# EAGLE design mr_radar_sandbox (EAGLE 5.11)
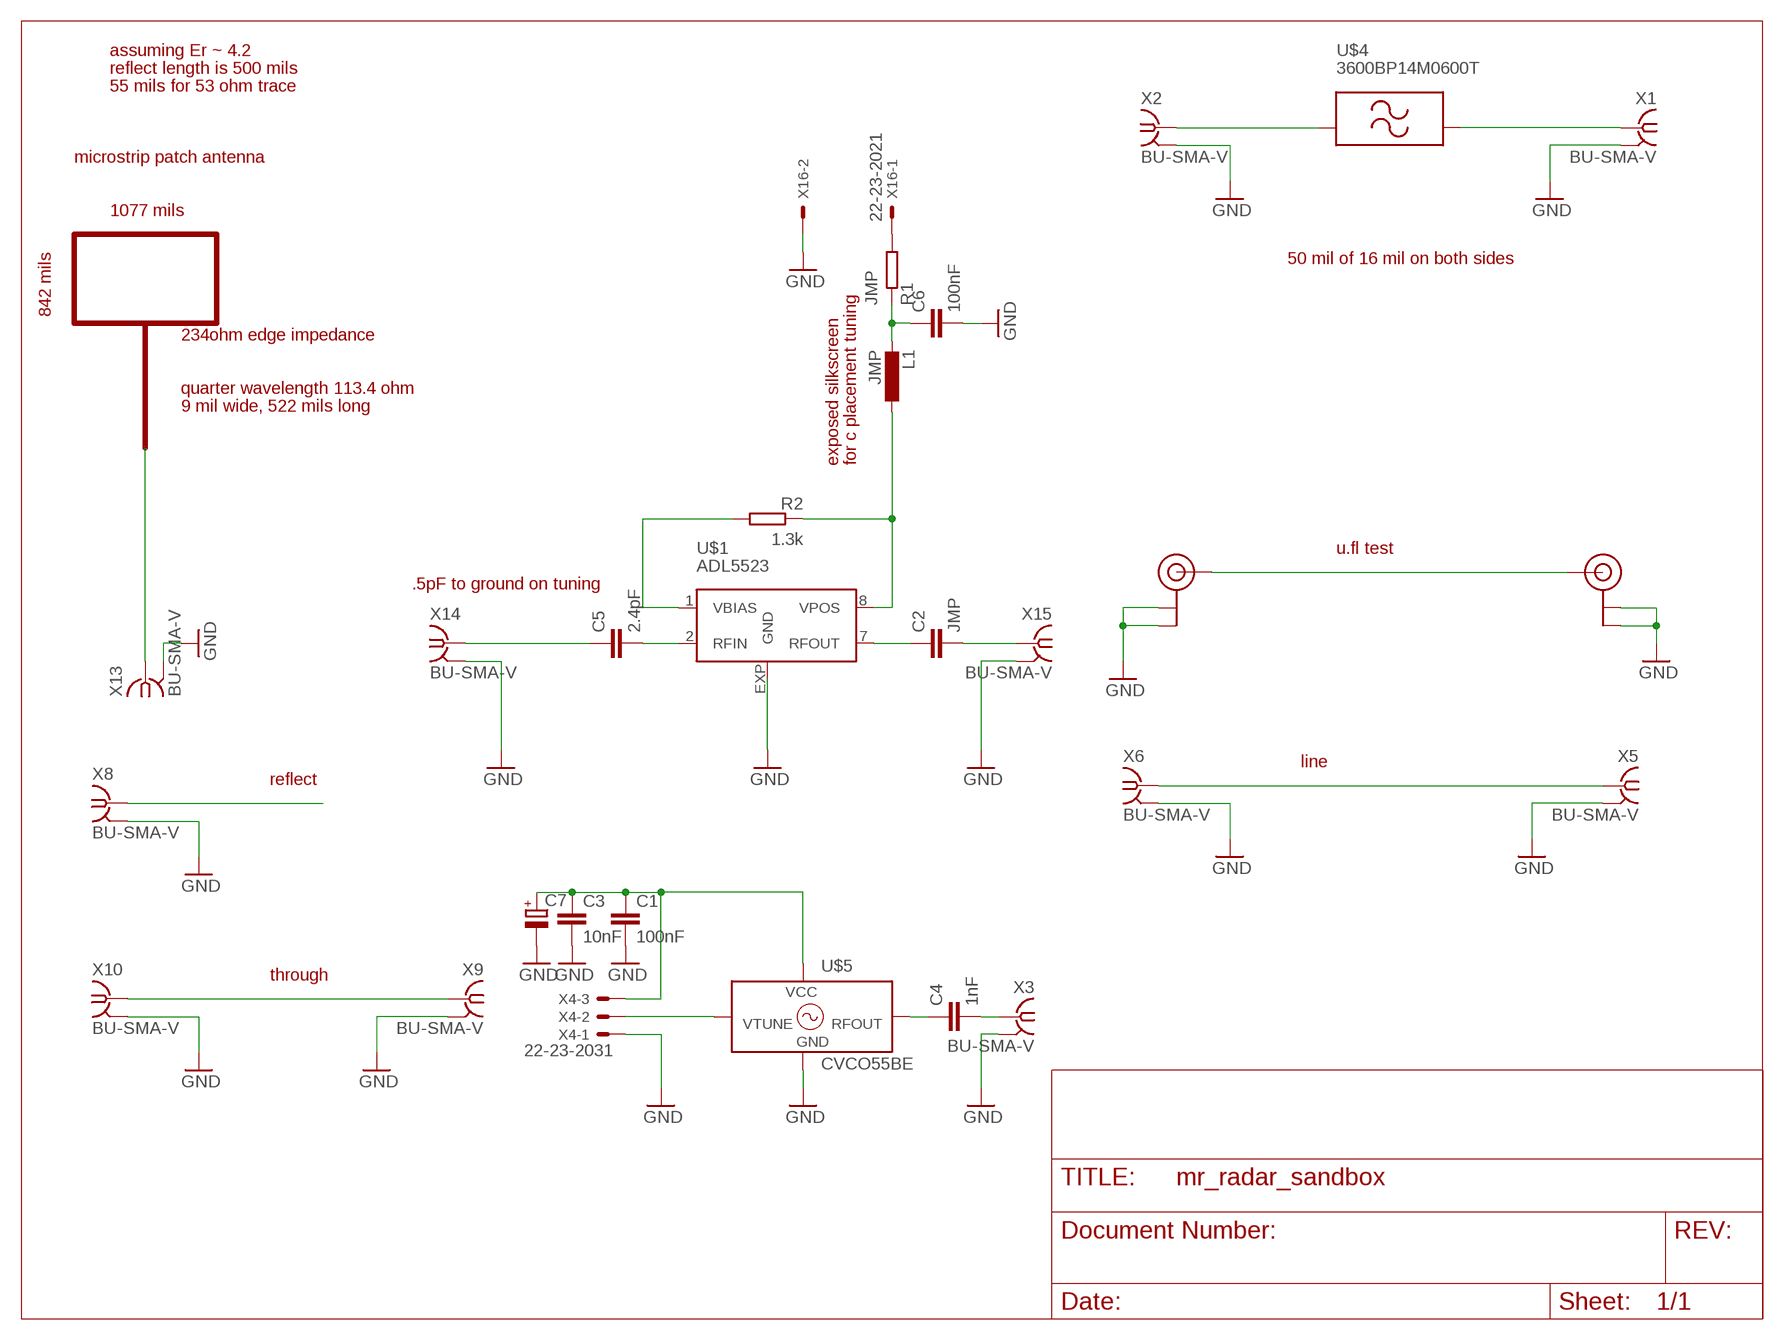
[diagram p0: schematic, sheet 1]

## Parts
C1  100nF  CAPACITOR-0402  [0402-CAP]
C2  JMP  CAPACITOR-0402  [0402-CAP]
C3  10nF  CAPACITOR-0402  [0402-CAP]
C4  1nF  CAPACITOR-0402  [0402-CAP]
C5  2.4pF  CAPACITOR-0402  [0402-CAP]
C6  100nF  CAPACITOR-0402  [0402-CAP]
C7  CAPACITOR-POL-0805  [0805-POL-CAP]
L1  JMP  INDUCTOR-0402  [0402-IND]
R1  JMP  RESISTOR-0603  [0603-RES]
R2  1.3k  RESISTOR-0603  [0603-RES]
U$1  ADL5523  [LFCSP8]
U$2  U.FL  [U.FL]
U$3  U.FL  [U.FL]
U$4  3600BP14M0600T  [3600BP14M0600T]
U$5  CVCO55BE  [CVCO55BE]
X1  BU-SMA-V  [BU-SMA-V]
X2  BU-SMA-V  [BU-SMA-V]
X3  BU-SMA-V  [BU-SMA-V]
X4  22-23-2031  [22-23-2031]
X5  BU-SMA-V  [BU-SMA-V]
X6  BU-SMA-V  [BU-SMA-V]
X8  BU-SMA-V  [BU-SMA-V]
X9  BU-SMA-V  [BU-SMA-V]
X10  BU-SMA-V  [BU-SMA-V]
X13  BU-SMA-V  [BU-SMA-V]
X14  BU-SMA-V  [BU-SMA-V]
X15  BU-SMA-V  [BU-SMA-V]
X16  22-23-2021  [22-23-2021]

## Nets
GND: C1.P$2 C3.P$2 C6.P$2 C7.- U$1.EXP(GND) U$2.P$1(GND) U$2.P$2(GND) U$3.P$1(GND) U$3.P$2(GND) U$5.P$1(GND) X1.2(GND) X2.2(GND) X3.2(GND) X4.1 X5.2(GND) X6.2(GND) X8.2(GND) X9.2(GND) X10.2(GND) X13.2(GND) X14.2(GND) X15.2(GND) X16.2
N$1: U$4.P$1 X2.1
N$2: U$4.P$2 X1.1
N$3: C4.P$1 U$5.P$RFOUT(RFOUT)
N$4: X8.1
N$5: C4.P$2 X3.1
N$6: X5.1 X6.1
N$7: X13.1
N$8: X9.1 X10.1
N$9: U$5.P$VT(VTUNE) X4.2
N$10: U$2.P$3(SIGNAL) U$3.P$3(SIGNAL)
N$11: R2.P$2 U$1.1(VBIAS)
N$12: L1.P$1 R2.P$1 U$1.8(VPOS)
N$13: C5.P$1 X14.1
N$14: C5.P$2 U$1.2(RFIN)
N$15: R1.P$2 X16.1
N$16: C2.P$1 U$1.7(RFOUT)
N$17: C2.P$2 X15.1
N$18: C1.P$1 C3.P$1 C7.+ U$5.P$VCC(VCC) X4.3
N$19: C6.P$1 L1.P$2 R1.P$1

## Notes on the sheet
- assuming Er ~ 4.2
- reflect length is 500 mils
- 55 mils for 53 ohm trace
- microstrip patch antenna
- 1077 mils
- 842 mils | 50 mil of 16 mil on both sides
- 234ohm edge impedance
- quarter wavelength 113.4 ohm
- 9 mil wide, 522 mils long
- exposed silkscreen | for c placement tuning
- u.fl test
- .5pF to ground on tuning
- line
- reflect
- through

## Power pins joined to a net without a drawn wire
GND: U$1.3(GND) U$1.4(GND) U$1.5(GND) U$1.6(GND) U$4.P$GND0(GND) U$4.P$GND1(GND) U$5.P$3(GND) U$5.P$4(GND) U$5.P$5(GND) U$5.P$6(GND) U$5.P$8(GND) U$5.P$9(GND) U$5.P$10(GND) U$5.P$11(GND) U$5.P$12(GND) U$5.P$13(GND) U$5.P$15(GND) U$5.P$16(GND) X1.3(GND) X1.4(GND) X1.5(GND) X2.3(GND) X2.4(GND) X2.5(GND) X3.3(GND) X3.4(GND) X3.5(GND) X5.3(GND) X5.4(GND) X5.5(GND) X6.3(GND) X6.4(GND) X6.5(GND) X8.3(GND) X8.4(GND) X8.5(GND) X9.3(GND) X9.4(GND) X9.5(GND) X10.3(GND) X10.4(GND) X10.5(GND) X13.3(GND) X13.4(GND) X13.5(GND) X14.3(GND) X14.4(GND) X14.5(GND) X15.3(GND) X15.4(GND) X15.5(GND)

## Library data of the parts
C1-C6 = pel_dipol_comp:CAPACITOR
C7 = pel_dipol_comp:CAPACITOR-POL
L1 = pel_dipol_comp:INDUCTOR
R1 R2 = pel_dipol_comp:RESISTOR
U$1 = mr_radar:ADL5523
U$2 U$3 = SparkFun:U.FL
U$4 = mr_radar:3600BP14M0600T
U$5 = mr_radar:CVCO55BE
X1-X3 X5 X6 X8-X10 X13-X15 = con-coax:BU-SMA-V: FEMALE SMA CONNECTOR Radiall distributor RS 112-3794; OC_FARNELL: unknown; OC_NEWARK: unknown
X4 = con-molex:22-23-2031: .100" (2.54mm) Center Header - 3 Pin; MF: MOLEX; MPN: 22-23-2031; OC_FARNELL: 1462950; OC_NEWARK: 30C0862
X16 = con-molex:22-23-2021: .100" (2.54mm) Center Header - 2 Pin; MF: MOLEX; MPN: 22-23-2021; OC_FARNELL: 1462926; OC_NEWARK: 25C3832

## Board
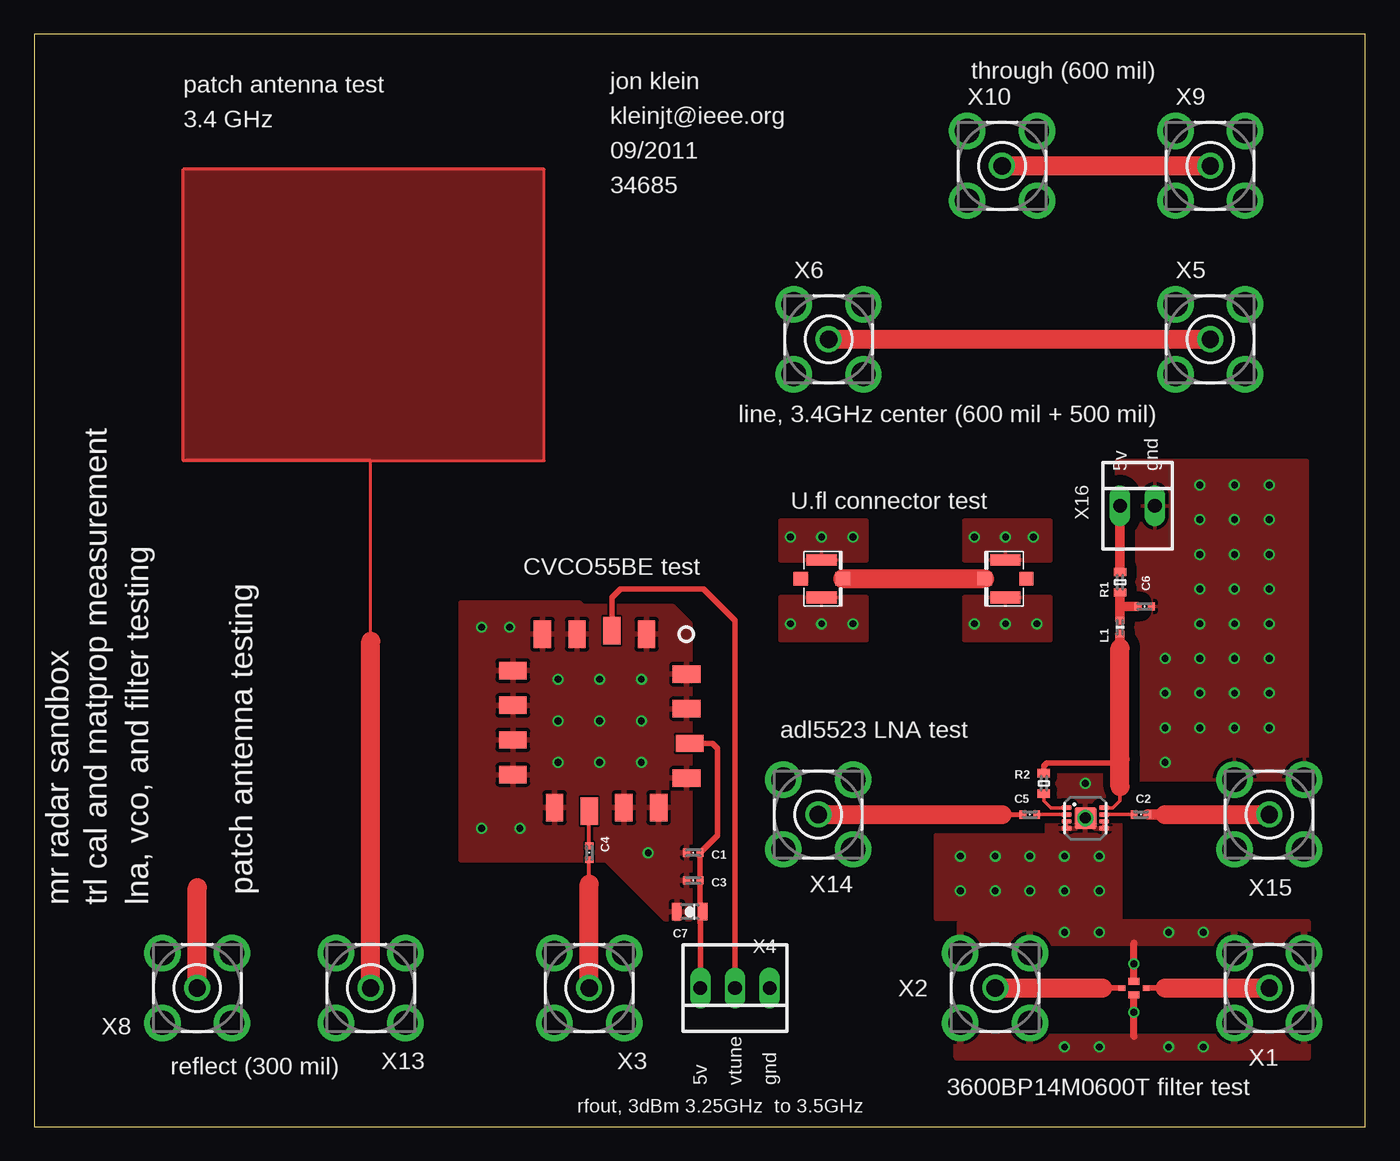
[diagram p1: board, top side]
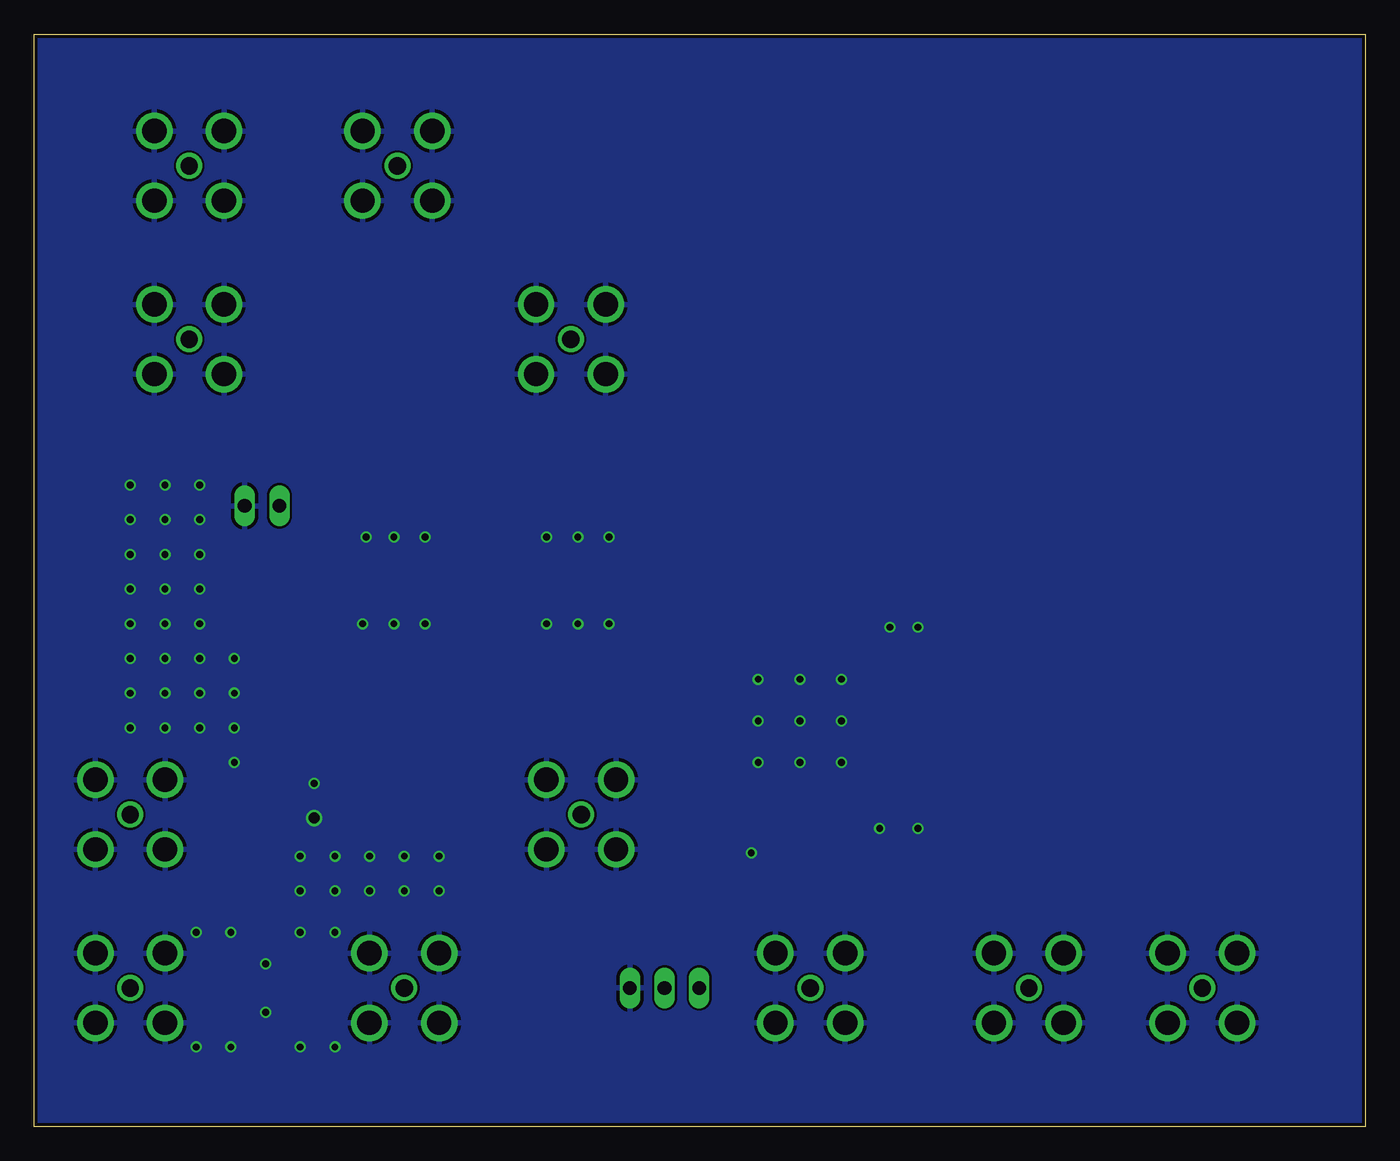
[diagram p2: board, bottom side, seen from below]

Size 97.46 x 80 mm. Coordinates in mm from the lower left corner, seen from the top.
Outline: 0,0 97.46,0 97.46,80 0,80 0,0
Copper layers (1*16): Top 0.035mm / dielectric 1.5mm / Bottom 0.035mm
Design rules "Fusion_eagle_rule_v1.1 *": minimum track width 6mil, minimum drill 12mil, track to track 6mil, track to pad 6mil, pad to pad 6mil, via to via 6mil, smd to smd 0mil, copper to edge 10mil, drill to drill 10mil, minimum pad ring 10mil, minimum via ring 6mil, stop-mask expansion 2mil, vias tented up to drill 100mil, thermal gap 10mil

### Footprints (pad centres in the part's own frame; a part is rotated, then mirrored left to right if it is on the bottom)
0402-CAP = smd 0.5 x 0.6: P$1 -0.5,0; P$2 0.5,0
0805-POL-CAP = smd 0.7 x 1.3: + -0.95,0; - 0.95,0
0402-IND = smd 0.5 x 0.6: P$1 -0.5,0; P$2 0.5,0
0603-RES = smd 0.6 x 0.9: P$1 -0.75,0; P$2 0.75,0
LFCSP8 = smd 0.7 x 0.35: 1 -1.375,0.75; 2 -1.375,0.25; 3 -1.375,-0.25; 4 -1.375,-0.75; 5 1.375,-0.75; 6 1.375,-0.25; 7 1.375,0.25; 8 1.375,0.75 | smd 1.6 x 1.6: EXP 0,0
U.FL = smd 2.2 x 0.85: P$1 0,1.375; P$2 0,-1.375 | smd 1.05 x 1: P$3 1.525,0; P$4 -1.525,0
3600BP14M0600T = smd 0.508 x 0.406: P$1 -0.889,0; P$2 0.889,0 | smd 0.813 x 0.508: P$GND0 0,0.483; P$GND1 0,-0.483
CVCO55BE = smd 1.27 x 2.032: P$1 -3.429,-6.35; P$3 1.651,-6.35; P$4 4.191,-6.35; P$9 -1.778,6.35; P$15 -4.318,6.35; P$16 3.302,6.35; P$RFOUT 0.762,6.604; P$VT -0.889,-6.604 | smd 2.032 x 1.27: P$5 -6.35,-3.429; P$6 -6.35,-0.889; P$8 -6.35,4.191; P$10 6.35,-3.683; P$11 6.35,-1.143; P$12 6.35,1.397; P$13 6.35,3.937; P$VCC -6.604,1.651
BU-SMA-V = drill 1.27 round: 1 0,0 | drill 1.778 round: 2 -2.55,2.55; 3 2.55,2.55; 4 2.55,-2.55; 5 -2.55,-2.55
22-23-2031 = drill 1 long: 1 -2.54,0; 2 0,0; 3 2.54,0
22-23-2021 = drill 1 long: 1 -1.27,0; 2 1.27,0

### Placement (x,y rotation side)
C1  48.26,20.07 180 top
C2  81.03,22.86 0 top
C3  48.26,18.03 180 top
C4  40.64,20.07 270 top
C5  72.9,22.86 0 top
C6  81.28,38.1 0 top
C7  48.01,15.75 180 top
L1  79.5,36.58 90 top
R1  79.5,39.88 90 top
R2  73.91,25.15 270 top
U$1  76.96,22.61 0 top
U$2  71.12,40.13 180 top
U$3  57.66,40.13 0 top
U$4  80.52,10.16 0 top
U$5  41.4,29.72 180 top
X1  90.42,10.16 0 top
X2  70.36,10.16 0 top
X3  40.64,10.16 90 top
X4  51.31,10.16 180 top
X5  86.11,57.66 0 top
X6  58.17,57.66 0 top
X8  11.94,10.16 0 top
X9  86.11,70.36 0 top
X10  70.87,70.36 0 top
X13  24.64,10.16 0 top
X14  57.4,22.86 180 top
X15  90.42,22.86 0 top
X16  80.77,45.47 0 top

### Tracks (layer width: path | path; a pad name or v marks a point on that pad's centre or on a via)
GND  (via drill 0.5, 0.8)
  Top 0.254: U$1.4 U$1.3 | U$1.6 U$1.5
  Top 0.508: 80.52,6.6 U$4.P$GND1 | U$4.P$GND0 80.52,13.46
  other vias: 80.52,11.94 80.52,8.38 83.06,5.84 77.98,5.84 75.44,5.84 85.6,5.84 83.06,14.22 85.6,14.22 77.98,14.22 75.44,14.22 76.96,22.61 76.96,25.15 75.44,17.27 75.44,19.81 77.98,19.81 77.98,17.27 55.37,43.18 57.66,43.18 59.94,43.18 57.66,36.83 59.94,36.83 55.37,36.83 71.12,36.83 73.41,36.83 68.83,36.83 71.12,43.18 73.15,43.18 68.83,43.18 72.9,17.27 70.36,17.27 70.36,19.81 72.9,19.81 67.82,19.81 67.82,17.27 82.8,29.21 85.34,29.21 82.8,26.67 82.8,31.75 82.8,34.29 85.34,34.29 85.34,31.75 85.34,36.83 41.4,29.72 44.45,29.72 44.45,32.77 41.4,32.77 38.35,32.77 38.35,29.72 38.35,26.67 41.4,26.67 44.45,26.67 44.96,20.07 35.56,21.84 32.77,21.84 32.77,36.58 34.8,36.58 87.88,29.21 87.88,34.29 87.88,31.75 87.88,36.83 90.42,29.21 90.42,34.29 90.42,31.75 90.42,36.83 85.34,39.37 85.34,44.45 85.34,41.91 85.34,46.99 87.88,39.37 87.88,44.45 87.88,41.91 87.88,46.99 90.42,39.37 90.42,44.45 90.42,41.91 90.42,46.99
  pour Bottom: 0,80.01 0,0 97.79,0 97.79,80.01
  pour Top: 93.22,13.46 67.82,13.46 67.82,14.99 93.22,14.99
  pour Top: 67.56,6.6 93.22,6.6 93.22,5.08 67.56,5.33
  pour Top: 67.56,6.6 93.22,6.35 93.22,5.08 67.56,5.08
  pour Top (isolate 0.508): 74.17,25.91 79.5,25.91 79.5,15.24 66.04,15.24 66.04,21.34 74.17,21.34
  pour Top (isolate 0.762): 79.25,48.77 79.25,25.4 93.22,25.4 93.22,48.77
  pour Top: 54.61,44.45 60.96,44.45 60.96,41.4 54.61,41.4
  pour Top: 54.61,38.86 60.96,38.86 60.96,35.56 54.61,35.56
  pour Top: 68.07,38.86 74.42,38.86 74.42,35.56 68.07,35.56
  pour Top: 68.07,44.45 74.42,44.45 74.42,41.4 68.07,41.4
  pour Top: 31.24,38.35 31.24,19.56 41.91,19.56 46.23,15.24 48.01,15.24 48.01,36.83 46.74,38.1 40.13,38.1 39.88,38.35
N$1
  Top 0.406: 78.23,10.16 U$4.P$1
  Top 1.397: X2.1 78.23,10.16
N$2
  Top 0.406: U$4.P$2 82.8,10.16
  Top 1.397: 82.8,10.16 X1.1
N$3
  Top 0.305: C4.P$1 U$5.P$RFOUT
N$4
  Top 1.397: X8.1 11.94,17.53
N$5
  Top 0.305: 40.64,17.78 C4.P$2
  Top 1.397: X3.1 40.64,17.78
N$6
  Top 1.397: X6.1 X5.1
N$7
  Top 0.229: 24.64,35.56 24.64,48.77 | 24.64,48.77 10.92,48.77 10.92,70.1 37.34,70.1 37.34,48.77 24.64,48.77
  Top 1.397: X13.1 24.64,35.56
  pour Top: 10.92,70.1 10.92,48.77 37.34,48.77 37.34,70.1
N$8
  Top 1.397: X10.1 X9.1
N$9
  Top 0.406: X4.2 51.31,37.08 49.02,39.37 42.93,39.37 42.29,38.73 U$5.P$VT
N$10
  Top 1.397: U$3.P$3 U$2.P$3
N$11
  Top 0.254: U$1.1 74.43,23.36 73.91,23.88 R2.P$2
N$12
  Top 0.254: U$1.8 78.98,23.36 79.5,23.88 79.5,24.89 | R2.P$1
  Top 0.305: 79.5,26.92 79.24,26.66
  Top 0.406: R2.P$1 73.91,26.42 74.16,26.66 79.24,26.66
  Top 0.711: 79.5,35.05 L1.P$1
  Top 1.397: 79.5,35.05 79.5,26.92 79.5,24.89
N$13
  Top 0.356: 70.87,22.86 C5.P$1
  Top 1.397: X14.1 70.87,22.86
N$14
  Top 0.254: U$1.2 C5.P$2
  Top 0.356: U$1.2
N$15
  Top 0.711: R1.P$2 X16.1
N$16
  Top 0.254: U$1.7 C2.P$1
  Top 0.356: C2.P$1
N$17
  Top 0.762: C2.P$2 82.8,22.86
  Top 1.397: 82.8,22.86 X15.1
N$18
  Top 0.254: C7.+ 48.77,15.56 48.77,14.99
  Top 0.406: 48.83,10.16 X4.3 48.77,14.99 48.76,14.99 C3.P$1 C1.P$1 50.04,21.34 50.04,27.69 49.66,28.07 U$5.P$VCC
N$19
  Top 0.711: L1.P$2 79.5,38.1 | 79.5,38.1 R1.P$1 | 79.5,38.1 C6.P$1

### Text on the board
_tsilk: through (600 mil) | patch antenna test | jon klein | 3.4 GHz | kleinjt@ieee.org | 09/2011 | 34685 | line, 3.4GHz center (600 mil + 500 mil) | 5v | gnd | U.fl connector test | CVCO55BE test | adl5523 LNA test | patch antenna testing | mr radar sandbox | trl cal and matprop measurement | lna, vco, and filter testing | reflect (300 mil) | 5v | vtune | gnd | rfout, 3dBm 3.25GHz to 3.5GHz | 3600BP14M0600T filter test